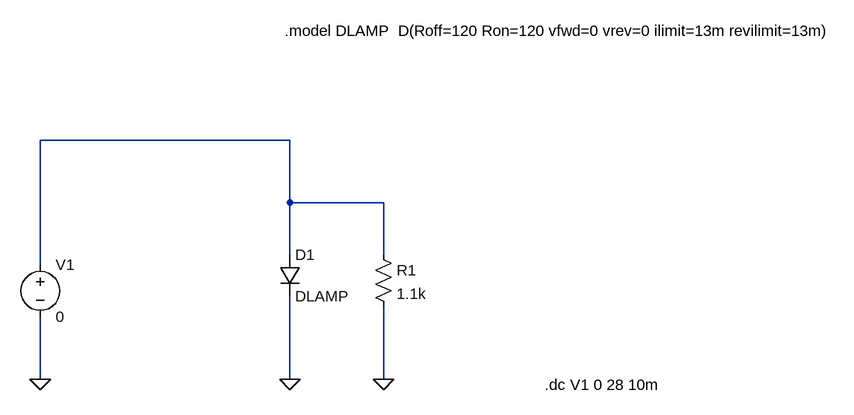
[diagram p0: schematic Lamp.asc]
Lamp.asc, the LTspice schematic file:
Version 4
SHEET 1 2364 1172
WIRE 208 -432 -176 -432
WIRE 208 -336 208 -432
WIRE 352 -336 208 -336
WIRE 208 -256 208 -336
WIRE 352 -256 352 -336
WIRE -176 -240 -176 -432
WIRE -176 -64 -176 -160
WIRE 208 -64 208 -192
WIRE 352 -64 352 -176
FLAG 208 -64 0
FLAG -176 -64 0
FLAG 352 -64 0
SYMBOL diode 192 -256 R0
SYMATTR InstName D1
SYMATTR Value DLAMP
SYMBOL voltage -176 -256 R0
WINDOW 123 0 0 Left 2
WINDOW 39 0 0 Left 2
SYMATTR InstName V1
SYMATTR Value 0
SYMBOL res 336 -272 R0
SYMATTR InstName R1
SYMATTR Value 1.1k
TEXT 200 -600 Left 2 !.model DLAMP  D(Roff=120 Ron=120 vfwd=0 vrev=0 ilimit=13m revilimit=13m)
TEXT 600 -56 Left 2 !.dc V1 0 28 10m

The netlist it stands for:
* Lamp.asc
D1 N001 0 DLAMP
V1 N001 0 0
R1 N001 0 1.1k
.model D D
.lib standard.dio
.model DLAMP  D(Roff=120 Ron=120 vfwd=0 vrev=0 ilimit=13m revilimit=13m)
.dc V1 0 28 10m
.backanno
.end